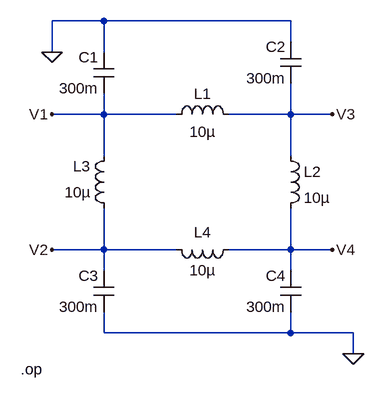
[diagram p0: schematic ejemplo4.asc]
ejemplo4.asc, the LTspice schematic file:
Version 4
SHEET 1 880 680
WIRE 128 -64 48 -64
WIRE 416 -64 128 -64
WIRE 416 -32 416 -64
WIRE 48 -16 48 -64
WIRE 128 -16 128 -64
WIRE 128 80 128 48
WIRE 128 80 48 80
WIRE 240 80 128 80
WIRE 416 80 416 32
WIRE 416 80 320 80
WIRE 480 80 416 80
WIRE 128 144 128 80
WIRE 416 144 416 80
WIRE 128 288 128 224
WIRE 128 288 48 288
WIRE 240 288 128 288
WIRE 416 288 416 224
WIRE 416 288 320 288
WIRE 480 288 416 288
WIRE 128 320 128 288
WIRE 416 320 416 288
WIRE 128 416 128 384
WIRE 416 416 416 384
WIRE 416 416 128 416
WIRE 512 416 416 416
WIRE 512 448 512 416
FLAG 48 80 V1
FLAG 48 288 V2
FLAG 480 80 V3
FLAG 480 288 V4
FLAG 48 -16 0
FLAG 512 448 0
SYMBOL ind 224 96 R270
WINDOW 0 32 56 VTop 2
WINDOW 3 5 56 VBottom 2
SYMATTR InstName L1
SYMATTR Value 10µ
SYMBOL ind 400 128 R0
SYMATTR InstName L2
SYMATTR Value 10µ
SYMBOL ind 144 240 R180
WINDOW 0 36 80 Left 2
WINDOW 3 36 40 Left 2
SYMATTR InstName L3
SYMATTR Value 10µ
SYMBOL ind 336 272 R90
WINDOW 0 5 56 VBottom 2
WINDOW 3 32 56 VTop 2
SYMATTR InstName L4
SYMATTR Value 10µ
SYMBOL cap 144 48 R180
WINDOW 0 24 56 Left 2
WINDOW 3 24 8 Left 2
SYMATTR InstName C1
SYMATTR Value 300m
SYMBOL cap 432 32 R180
WINDOW 0 24 56 Left 2
WINDOW 3 24 8 Left 2
SYMATTR InstName C2
SYMATTR Value 300m
SYMBOL cap 144 384 R180
WINDOW 0 24 56 Left 2
WINDOW 3 24 8 Left 2
SYMATTR InstName C3
SYMATTR Value 300m
SYMBOL cap 432 384 R180
WINDOW 0 24 56 Left 2
WINDOW 3 24 8 Left 2
SYMATTR InstName C4
SYMATTR Value 300m
TEXT 0 472 Left 2 !.op

The netlist it stands for:
* ejemplo4.asc
L1 V1 V3 10µ
L2 V3 V4 10µ
L3 V2 V1 10µ
L4 V4 V2 10µ
C1 V1 0 300m
C2 V3 0 300m
C3 0 V2 300m
C4 0 V4 300m
.op
.backanno
.end